# Altium schematic sheet CC_oct_driver.SchDoc
size A4; SheetNumber: 5; SheetTotal: 7
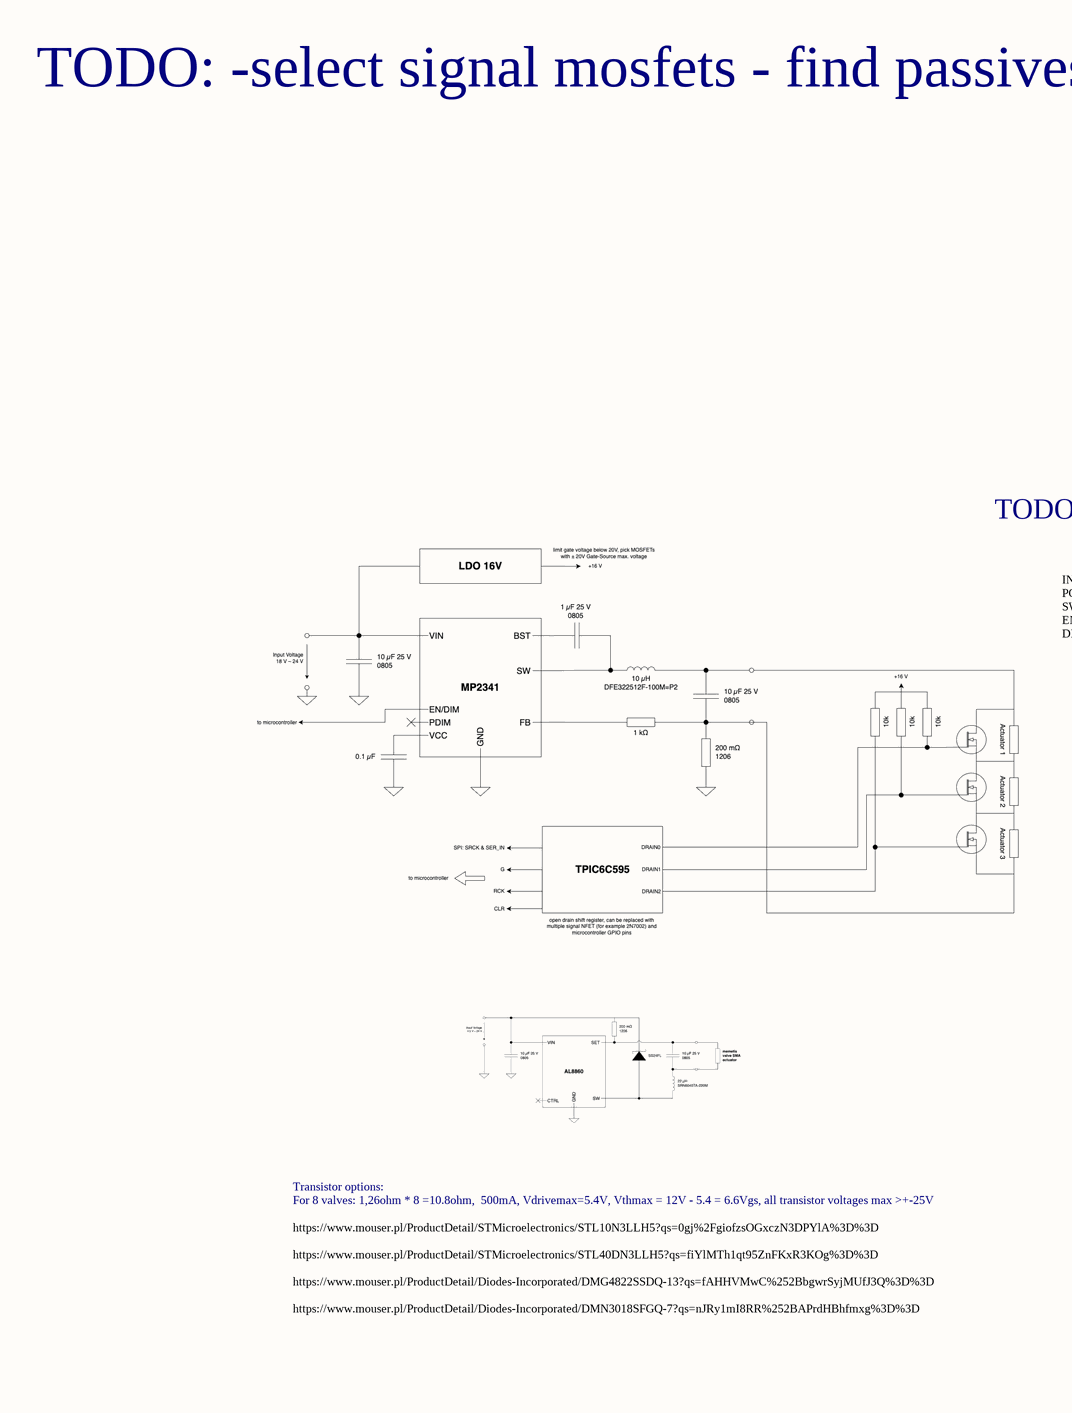
[diagram p0: CC_oct_driver.SchDoc, left]
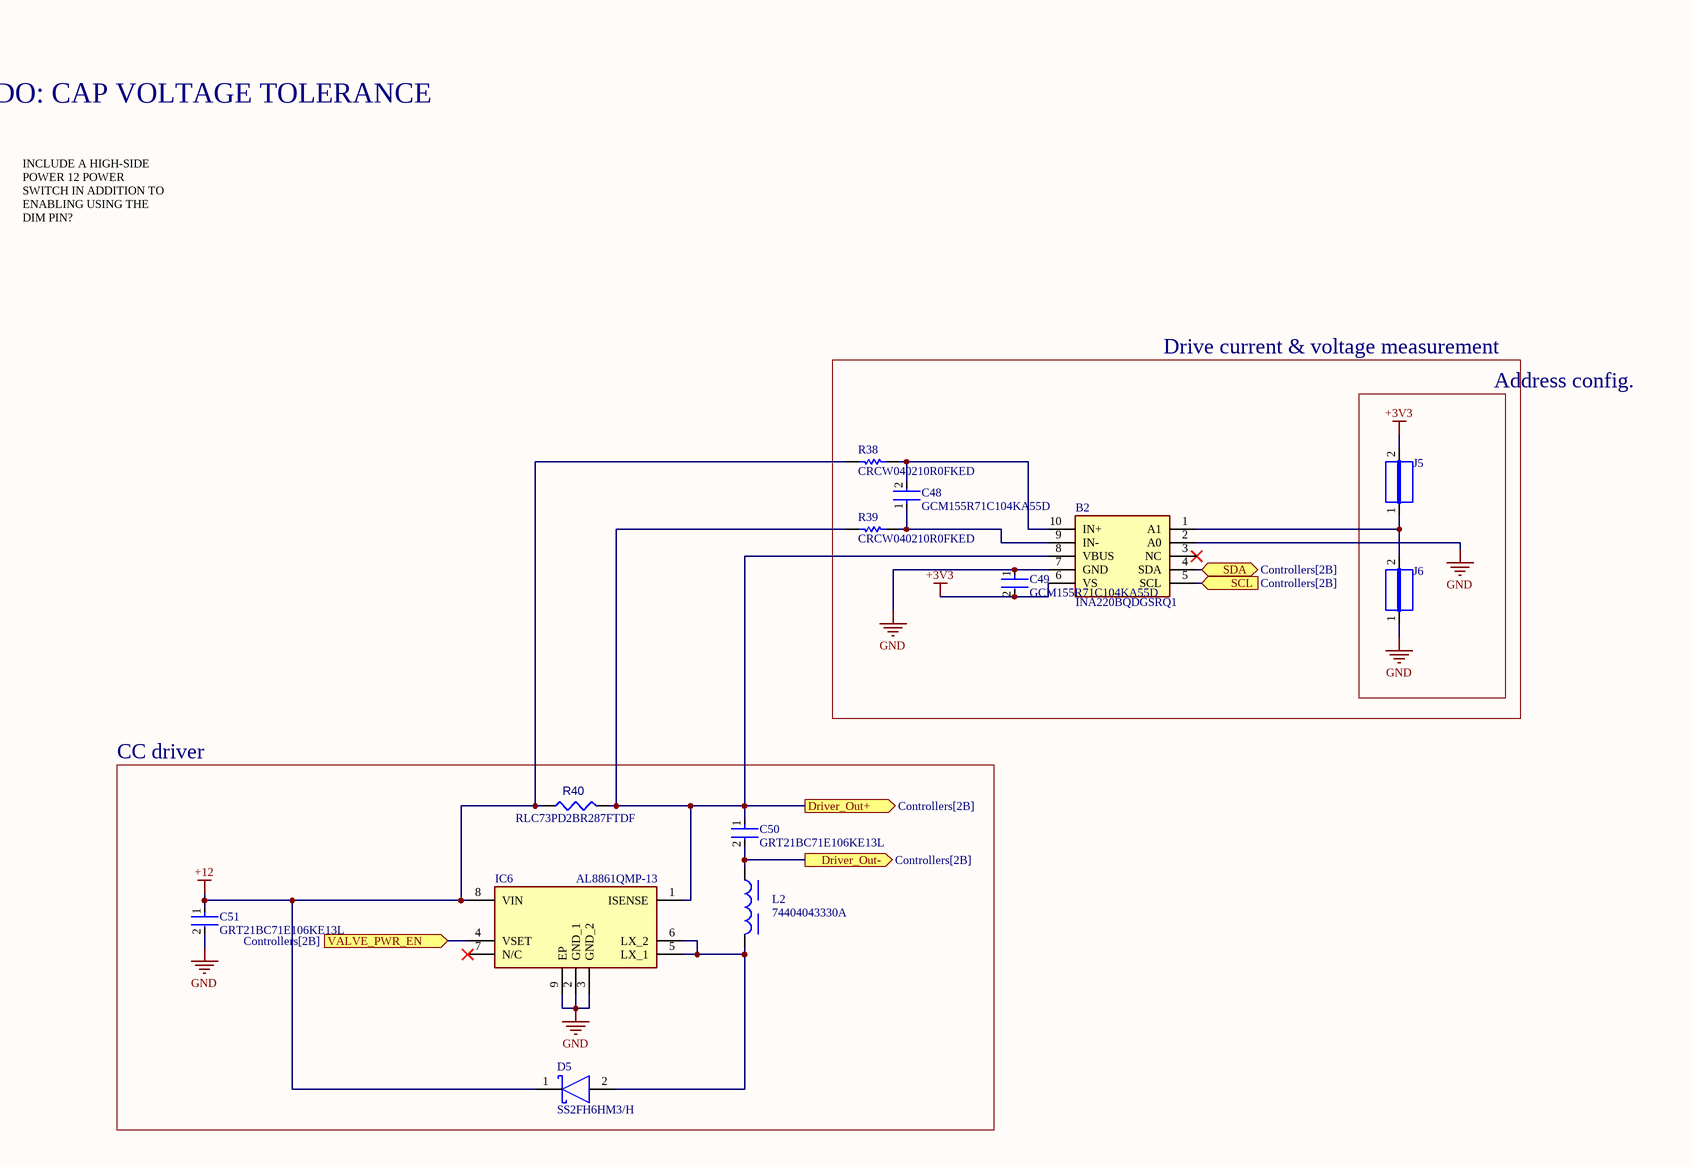
[diagram p1: CC_oct_driver.SchDoc, right]

## Parts
B2  INA220BQDGSRQ1  [SOP50P490X110-10N]
C48  GCM155R71C104KA55D  [FP-GCM155-0_05-IPC_C]
C49  GCM155R71C104KA55D  [FP-GCM155-0_05-IPC_C]
C50  GRT21BC71E106KE13L  [FP-GRT21B-0_2-IPC_B]
C51  GRT21BC71E106KE13L  [FP-GRT21B-0_2-IPC_B]
D5  SS2FH6HM3/H  [FP-S8-V-3915_01-001-MFG]
IC6  AL8861QMP-13  [SOP65P490X110-9N]
J5  JUMPER  [JUMPER]  (value not drawn)
J6  JUMPER  [JUMPER]  (value not drawn)
L2  74404043330A  [WE-LQS_4025]
R38  CRCW040210R0FKED  [RESC1005X40X25NL05T05]
R39  CRCW040210R0FKED  [RESC1005X40X25NL05T05]
R40  RLC73PD2BR287FTDF  [R1206]

## Blocks framed on the sheet
Drive current & voltage measurement: B2 C48 C49 R38 R39
Address config.: J5 J6
CC driver: C50 C51 D5 IC6 L2 R40

## Ports
Driver_Out+ (out, see Controllers[2B]), Driver_Out- (out, see Controllers[2B]), SCL (in, see Controllers[2B]), SDA (bidir, see Controllers[2B]), VALVE_PWR_EN (in, see Controllers[2B])

## Nets
+3V3: B2.6(VS) C49.2 J5.2
+12: C51.1 D5.1(C) IC6.8(VIN) R38.1 R40.1
GND: B2.2(A0) B2.7(GND) C49.1 C51.2 IC6.2(GND_1) IC6.3(GND_2) IC6.9(EP) J6.1
Driver_Out+: B2.8(VBUS) C50.1 IC6.1(ISENSE) R39.1 R40.2 ; port Driver_Out+
Driver_Out-: C50.2 L2.1 ; port Driver_Out-
SCL: B2.5(SCL) ; port SCL
SDA: B2.4(SDA) ; port SDA
VALVE_PWR_EN: IC6.4(VSET) ; port VALVE_PWR_EN
NetB2_1: B2.1(A1) J5.1 J6.2
NetB2_9: B2.9(IN-) C48.1 R39.2
NetB2_10: B2.10(IN+) C48.2 R38.2
NetD5_2: D5.2(A) IC6.5(LX_1) IC6.6(LX_2) L2.2

Not connected (* = marked no-connect by the designer): B2 3(NC)*; IC6 7(N/C)*

## Notes on the sheet
- TODO: -select signal mosfets - find passives(or replace them with gate drivers), CALCULATE THE SWITCHING FREQUENCY AND INDUCTANCE
- TODO: CAP VOLTAGE TOLERANCE
- INCLUDE A HIGH-SIDE POWER 12 POWER SWITCH IN ADDITION TO ENABLING USING THE DIM PIN?
- For 8 valves: 1,26ohm * 8 =10.8ohm,  500mA, Vdrivemax=5.4V, Vthmax = 12V - 5.4 = 6.6Vgs, all transistor voltages max >+-25V
- Transistor options:
- https://www.mouser.pl/ProductDetail/STMicroelectronics/STL10N3LLH5?qs=0gj%2FgiofzsOGxczN3DPYlA%3D%3D
- https://www.mouser.pl/ProductDetail/STMicroelectronics/STL40DN3LLH5?qs=fiYlMTh1qt95ZnFKxR3KOg%3D%3D
- https://www.mouser.pl/ProductDetail/Diodes-Incorporated/DMG4822SSDQ-13?qs=fAHHVMwC%252BbgwrSyjMUfJ3Q%3D%3D
- https://www.mouser.pl/ProductDetail/Diodes-Incorporated/DMN3018SFGQ-7?qs=nJRy1mI8RR%252BAPrdHBhfmxg%3D%3D

## Library data of the parts
B2 = INA220BQDGSRQ1: Automotive, 26-V, Bi-Directional, Zero-Drift, Low-/High-Side, I2C Out Current/Power Monitor; Manufacturer_Name: Texas Instruments; Geometry.Height: 1.1mm; Mouser Part Number: 595-INA220BQDGSRQ1; Mouser Price/Stock: https://www.mouser.co.uk/ProductDetail/Texas-Instruments/INA220BQDGSRQ1?qs=4whTb%2F0XQMgSmfUlXJGxRQ%3D%3D; Manufacturer_Part_Number: INA220BQDGSRQ1; Datasheet Link: http://www.ti.com/lit/gpn/ina220-q1
C48 C49 = CMP-2008-03711-3: Ceramic Capacitor for Automotive 100nF ±10% 16VDC X7R 0402 Paper T/R; Voltage Rating (DC): 16V; Termination: SMD/SMT; Length: 1mm; Voltage: 16V; Mount: Surface Mount; Packaging: Tape and Reel; Case Code (Metric): 1005; Case/Package: 0402; Voltage Rating: 16V; Min Operating Temperature: -55°C; Case Code (Imperial): 0402; Ratings: AEC-Q200; Height: 0.5mm; Tolerance: 10%; Width: 0.02inch; Radiation Hardening: No; Depth: 0.5mm; Capacitance: 100nF; Max Operating Temperature: 125°C; Package Quantity: 1; REACH SVHC: No SVHC; Thickness: 0.022inch; Dielectric: X7R; Lead Free: Lead Free
C50 C51 = CMP-06035-008164-1: Multi-Layer Ceramic Capacitor 10uF 25V X7S ±10% 0805 Emboss T/R
D5 = CMP-00030-65895446-1: SS2FH6HM3/H Diode Schottky 60V 2A Automotive 2-Pin SMF T/R; Max Reverse Voltage (DC): 60V; Mount: Surface Mount; NexarPartId: 65895446; Average Rectified Current: 2A; RoHS: Compliant; Packaging: Cut Tape (CT); Schedule B: 8541100080, 8541100080
IC6 = AL8861QMP-13: LED Lighting Drivers LED MV Int Switch MSOP-8EP T&R 2.5K; Manufacturer_Name: Diodes Incorporated; Geometry.Height: 1.1mm; Datasheet Link: https://componentsearchengine.com/Datasheets/1/AL8861QMP-13.pdf; Manufacturer_Part_Number: AL8861QMP-13; Mouser Part Number: 621-AL8861QMP-13; Mouser Price/Stock: https://www.mouser.co.uk/ProductDetail/Diodes-Incorporated/AL8861QMP-13?qs=T3oQrply3y9Ug0fmv4aCFA%3D%3D
J5 J6 = CMP-009-00061-2: Pins: 2
L2 = CMP-03913-77814862-1: 74404043330A WE-LQS SMT Semi-Shielded Power Inductor; Current Rating: 880mA; Inductance Tolerance: 20%; Inductance: 33µH; DC Resistance (DCR): 316mΩ; Ambient Temperature Range High: 85°C; Min Operating Temperature: -40°C; Length: 4mm; Height: 2.5mm; RoHS: Compliant; Ambient Temperature Range Low: -40°C; Width: 4mm; Max Operating Temperature: 125°C; NexarPartId: 77814862
R38 R39 = CMP-2002-08143-1: Manufacturer: Vishay Dale; Part Number: CRCW040210R0FKED
R40 = Resistor: Value: RLC73PD2BR287FTDF